# Altium project TEMP_HUMIDITY_INDICATOR.PrjPcb
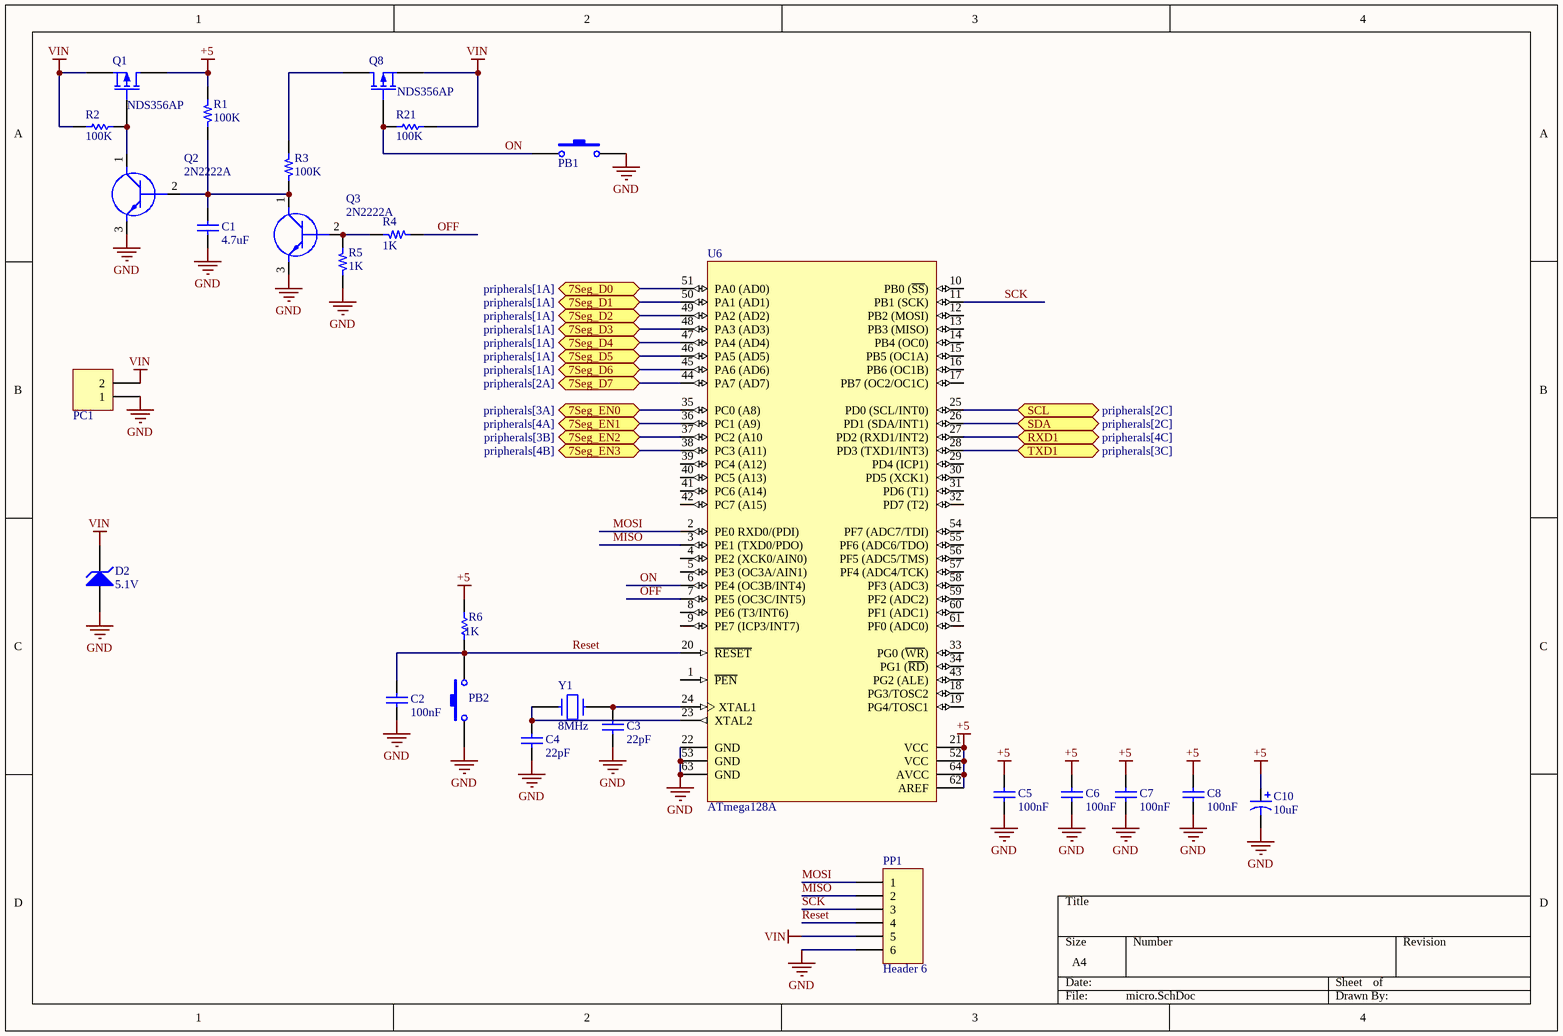
[diagram p0: micro.SchDoc]
2 sheets, 64 parts. Net scope: flat (ports and power ports of the same name join across sheets).
Board file: RHT.PcbDoc
Sheets:
  micro.SchDoc
  pripherals.SchDoc

## Sheet micro.SchDoc
size A4; SheetNumber: 1; SheetTotal: 2; SPICEModelCacheOPHJYIUV: <root> / <DocumentId>OPHJYIUV</DocumentId> / <CacheFrame Number="0"> / <Model Name="cap" Kind="MDL"> / <Text>*Default semiconductor capacitor / .MODEL CAP C()</Text> / </Model> / </CacheFrame> / </root>

### Parts
C1  value 4.7uF  [CAP0805]  (hidden comment: cap 4.7uF)
C2  value 100nF  [CAP0805]  (hidden comment: cap 100nF)
C3  value 22pF  [CAP0805]  (hidden comment: cap 22pF)
C4  value 22pF  [CAP0805]  (hidden comment: cap 22pF)
C5  value 100nF  [CAP0805]  (hidden comment: cap 100nF)
C6  value 100nF  [CAP0805]  (hidden comment: cap 100nF)
C7  value 100nF  [CAP0805]  (hidden comment: cap 100nF)
C8  value 100nF  [CAP0805]  (hidden comment: cap 100nF)
C10  value 10uF  [CAP0805]  (hidden comment: cap 10uF)
D2  5.1V  [Diode 1n4148 SMD]
PB1  Push-Button-tall  [tact-12mm]  (value not drawn)
PB2  Push-Button-tall  [tack-sw-3x5x6]  (value not drawn)
PC1  Power Connector  [My_ Power_Connector]  (value not drawn)
PP1  Header 6  [HDR1X6]
Q1  NDS356AP  [soT95p280x130-3n]
Q2  2N2222A  [soT95p280x130-3n]
Q3  2N2222A  [soT95p280x130-3n]
Q8  NDS356AP  [soT95p280x130-3n]
R1  100K  [RES0805]
R2  value 100K  [RES0805]  (hidden comment: Res 100K)
R3  100K  [RES0805]
R4  1K  [RES0805]
R5  1K  [RES0805]
R6  value 1K  [RES0805]  (hidden comment: Res 1K)
R21  value 100K  [RES0805]  (hidden comment: Res 100K)
U6  ATmega128A  [TQFP64_N]
Y1  8MHz  [My_Crystal]

### Ports
7Seg_D0 (bidir, see pripherals[1A]), 7Seg_D1 (bidir, see pripherals[1A]), 7Seg_D2 (bidir, see pripherals[1A]), 7Seg_D3 (bidir, see pripherals[1A]), 7Seg_D4 (bidir, see pripherals[1A]), 7Seg_D5 (bidir, see pripherals[1A]), 7Seg_D6 (bidir, see pripherals[1A]), 7Seg_D7 (bidir, see pripherals[2A]), 7Seg_EN0 (bidir, see pripherals[3A]), 7Seg_EN1 (bidir, see pripherals[4A]), 7Seg_EN2 (bidir, see pripherals[3B]), 7Seg_EN3 (bidir, see pripherals[4B]), RXD1 (bidir, see pripherals[4C]), SCL (bidir, see pripherals[2C]), SDA (bidir, see pripherals[2C]), TXD1 (bidir, see pripherals[3C])

### Nets
+5: C5.2 C6.2 C7.2 C8.2 C10.1 Q1.1(D) R1.1 R6.1 U6.21(VCC) U6.52(VCC) U6.62(AREF) U6.64(AVCC)
GND: C1.1 C2.1 C3.1 C4.1 C5.1 C6.1 C7.1 C8.1 C10.2 D2.1(A) PB1.2 PB2.1 PC1.1 PP1.6 Q2.3(E) Q3.3(E) R5.1 U6.22(GND) U6.53(GND) U6.63(GND)
VIN: D2.2(K) PC1.2 PP1.5 Q1.3(S) Q8.3(S) R2.1 R21.1
MISO: PP1.2 U6.3(PE1_(TXD0/PDO))
MOSI: PP1.1 U6.2(PE0_RXD0/(PDI))
OFF: R4.1 U6.7(PE5_(OC3C/INT5))
ON: PB1.1 Q8.2(G) R21.2 U6.6(PE4_(OC3B/INT4))
Reset: C2.2 PB2.2 PP1.4 R6.2 U6.20(~{RESET})
SCK: PP1.3 U6.11(PB1_(SCK))
SCL: U6.25(PD0_(SCL/INT0)) ; port SCL
SDA: U6.26(PD1_(SDA/INT1)) ; port SDA
NetC1_2: C1.2 Q2.2(B) Q3.1(C) R1.2 R3.2
NetC3_2: C3.2 U6.24(XTAL1) Y1.2
NetC4_2: C4.2 U6.23(XTAL2) Y1.1
NetQ1_2: Q1.2(G) Q2.1(C) R2.2
NetQ3_2: Q3.2(B) R4.2 R5.2
NetQ4_2: U6.35(PC0_(A8)) ; port 7Seg_EN0
NetQ5_2: U6.36(PC1_(A9)) ; port 7Seg_EN1
NetQ6_2: U6.37(PC2_(A10) ; port 7Seg_EN2
NetQ7_2: U6.38(PC3_(A11)) ; port 7Seg_EN3
NetQ8_1: Q8.1(D) R3.1
NetR16_1: U6.44(PA7_(AD7)) ; port 7Seg_D7
NetU4_1: U6.51(PA0_(AD0)) ; port 7Seg_D0
NetU4_2: U6.50(PA1_(AD1)) ; port 7Seg_D1
NetU4_3: U6.49(PA2_(AD2)) ; port 7Seg_D2
NetU4_4: U6.48(PA3_(AD3)) ; port 7Seg_D3
NetU4_5: U6.47(PA4_(AD4)) ; port 7Seg_D4
NetU4_6: U6.46(PA5_(AD5)) ; port 7Seg_D5
NetU4_7: U6.45(PA6_(AD6)) ; port 7Seg_D6
NetU5_1: U6.28(PD3_(TXD1/INT3)) ; port TXD1
NetU5_5: U6.27(PD2_(RXD1/INT2)) ; port RXD1

Not connected (* = marked no-connect by the designer): U6 1(~{PEN}) 4(PE2_(XCK0/AIN0)) 5(PE3_(OC3A/AIN1)) 8(PE6_(T3/INT6)) 9(PE7_(ICP3/INT7)) 10(PB0_(~{SS})) 12(PB2_(MOSI)) 13(PB3_(MISO)) 14(PB4_(OC0)) 15(PB5_(OC1A)) 16(PB6_(OC1B)) 17(PB7_(OC2/OC1C)) 18(PG3/TOSC2) 19(PG4/TOSC1) 29(PD4_(ICP1)) 30(PD5_(XCK1)) 31(PD6_(T1)) 32(PD7_(T2)) 33(PG0_(~{WR})) 34(PG1_(~{RD})) 39(PC4_(A12)) 40(PC5_(A13)) 41(PC6_(A14)) 42(PC7_(A15)) 43(PG2_(ALE)) 54(PF7_(ADC7/TDI)) 55(PF6_(ADC6/TDO)) 56(PF5_(ADC5/TMS)) 57(PF4_(ADC4/TCK)) 58(PF3_(ADC3)) 59(PF2_(ADC2)) 60(PF1_(ADC1)) 61(PF0_(ADC0))

### Library data of the parts
C1-C8 = Cap ceramic: CAP seramic
C10 = Cap Pol1: CAP seramic; Published: 8-Jun-2000; LatestRevisionDate: 17-Jul-2002; LatestRevisionNote: Re-released for DXP Platform.; PackageReference: RB7.6-15; Publisher: Altium Limited; PackageDescription: Polarized Capacitor (Radial); 2 Leads
D2 = D Zener: Zener Diode 5.1v; Published: 8-Jun-2000; LatestRevisionDate: 17-Jul-2002; LatestRevisionNote: Re-released for DXP Platform.; PackageReference: DIODE-0.7; Publisher: Altium Limited; PackageDescription: Diode, Thru-Hole; 2 Leads; 0.7 in Pin Spacing
PC1 = Power Connector: white Power Connector
PP1 = Header 6: Header, 6-Pin , female; LatestRevisionDate: 17-Jul-2002; LatestRevisionNote: Re-released for DXP Platform.; Publisher: Altium Limited
Q1 Q8 = MOSFET-P: P-Channel MOSFET SOT23; pin to pad: 1>3 2>1 3>2; Published: 8-Jun-2000; LatestRevisionDate: 17-Jul-2002; LatestRevisionNote: Re-released for DXP Platform.; PackageVersion: 1995/1996; PackageReference: E3; Publisher: Altium Limited; PackageDescription: TO, Flat Index; 3 In-Line, Axial Leads; Body Dia. 4.6mm; Lead Dia. 0.5 mm (max)
Q2 Q3 = 2N2222A: Transistor BJT NPN SMD; pin to pad: 1>3 2>1 3>2; Manufacturer_Name: Foshan Blue Rocket Elec; Datasheet Link: https://datasheet.lcsc.com/szlcsc/1901291437_Foshan-Blue-Rocket-Elec-2N2222A_C358533.pdf; Height: 4.7mm; Manufacturer_Part_Number: 2N2222A
R1 R3-R5 = Resistor: RES SMD 0603; Part Number: RCS0805100KFKEA
  R1 R3: Value: 100K
  R4 R5: Value: 1K
R2 R6 R21 = Res1: Resistor; Published: 8-Jun-2000; LatestRevisionDate: 17-Jul-2002; LatestRevisionNote: Re-released for DXP Platform.; PackageReference: AXIAL-0.3; Publisher: Altium Limited; PackageDescription: Axial Device, Thru-Hole; 2 Leads; 0.3 in Pin Spacing
U6 = ATmega128A: 8-bit AVR Microcontroller, 128KB Flash, 4KB EEPROM, 4KB SRAM, 64-pin TQFP, Industrial Grade (-40°C to 85°C); Published: 1-Apr-2010; DatasheetVersion: revE, Feb-2010; PackageVersion: revB, Oct-2001; PackageReference: 64A; Publisher: Altium Limited; PackageDescription: 64-Pin Plastic Thin Profile Quad Flat Pack, 14 x 14 x 1.0 mm Body, 0.8 mm Pitch (TQFP); Supplier 1: Digi-Key; Supplier Part Number 1: ATMEGA128A-AU-ND; Supplier 2: Farnell; Supplier Part Number 2: 1773397; Supplier 3: Mouser; Supplier Part Number 3: 556-ATMEGA128A-AU; Code_JEDEC: MS-026-AEB; ComponentLink1Description: Manufacturer Link; ComponentLink1URL: http://www.atmel.com/products/avr/default.asp?; ComponentLink2Description: ATmega128A Datasheet; ComponentLink2URL: http://www.atmel.com/dyn/resources/prod_documents/doc8151.pdf; ComponentLink3Description: ATmega128A Summary; ComponentLink3URL: http://www.atmel.com/dyn/resources/prod_documents/8151S.pdf; ComponentLink4Description: Atmel.com Home; ComponentLink4URL: http://www.atmel.com
Y1 = CRYSTAL

## Sheet pripherals.SchDoc
size A4; SheetNumber: 2; SheetTotal: 2; SPICEModelCacheJVNAYKJN: <root> / <DocumentId>JVNAYKJN</DocumentId> / <CacheFrame Number="0"> / <Model Name="cap" Kind="MDL"> / <Text>*Default semiconductor capacitor / .MODEL CAP C()</Text> / </Model> / </CacheFrame> / </root>
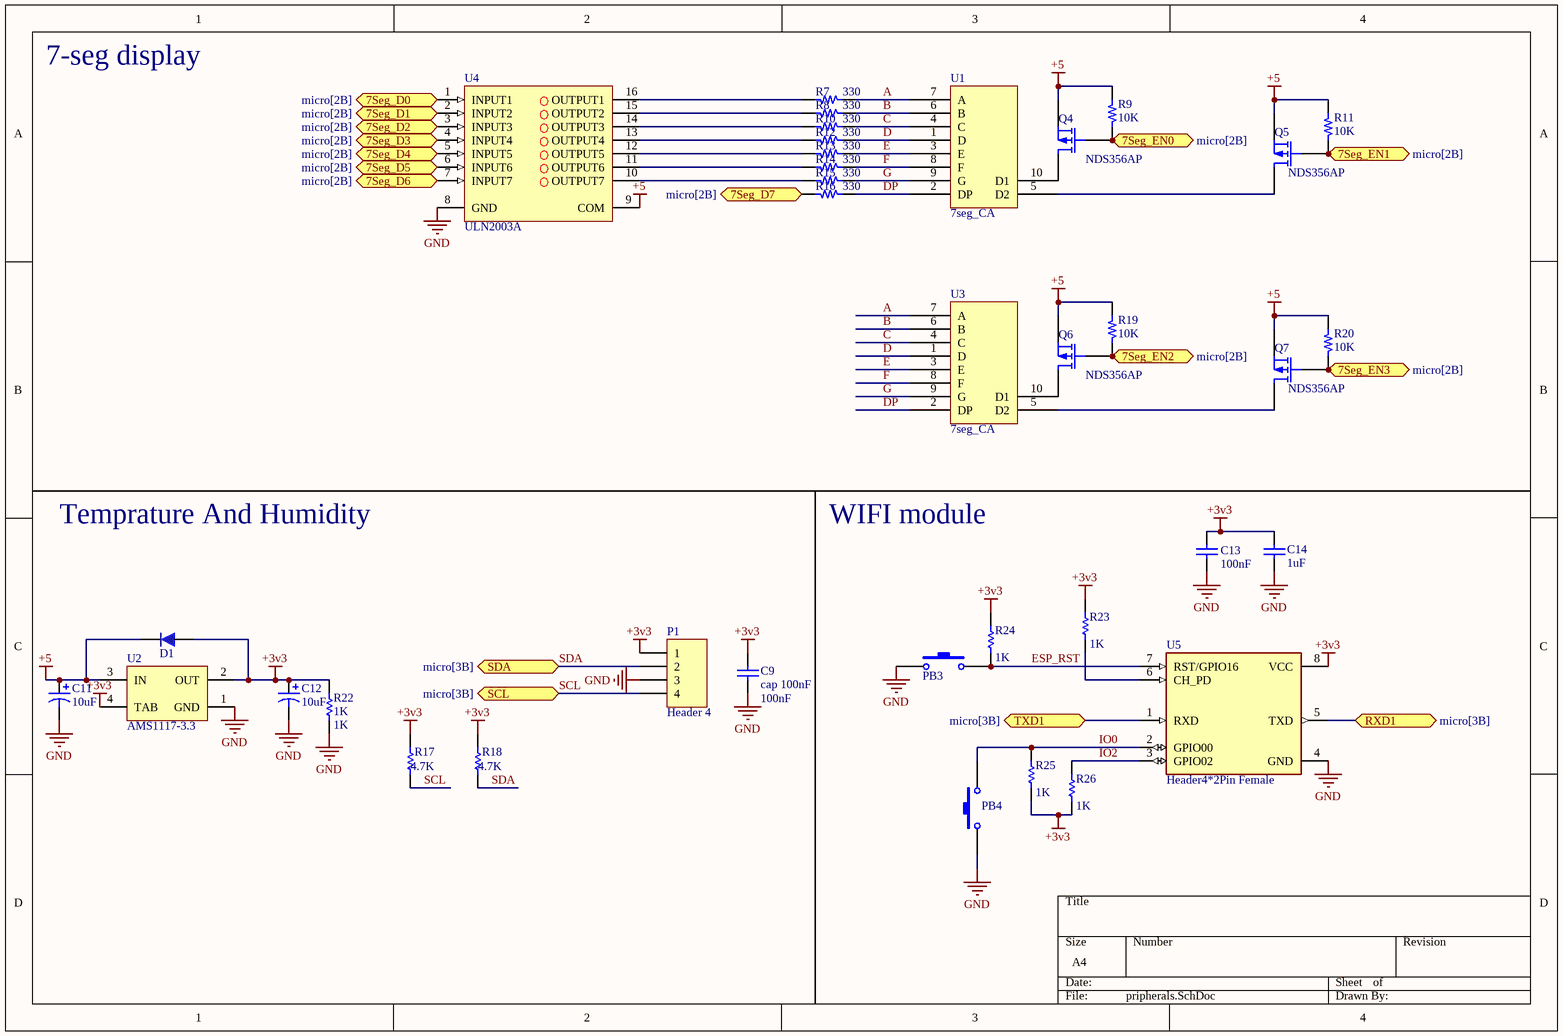
[diagram p1: pripherals.SchDoc]

### Parts
C9  cap 100nF  value 100nF  [Cap 805]
C11  value 10uF  [CAP0805]  (hidden comment: cap 10uF)
C12  value 10uF  [CAP0805]  (hidden comment: cap 10uF)
C13  value 100nF  [CAP0805]  (hidden comment: cap 100nF)
C14  value 1uF  [CAP0805]  (hidden comment: cap 1uF)
D1  uf4007  [DIOM4629X24N]  (value not drawn)
P1  Header 4  [HDR1X4]
PB3  Push-Button-tall  [tack-sw-3x5x6]  (value not drawn)
PB4  Push-Button-tall  [tack-sw-3x5x6]  (value not drawn)
Q4  NDS356AP  [soT95p280x130-3n]
Q5  NDS356AP  [soT95p280x130-3n]
Q6  NDS356AP  [soT95p280x130-3n]
Q7  NDS356AP  [soT95p280x130-3n]
R7  330  [RES0805]
R8  330  [RES0805]
R9  10K  [RES0805]
R10  330  [RES0805]
R11  10K  [RES0805]
R12  330  [RES0805]
R13  330  [RES0805]
R14  330  [RES0805]
R15  330  [RES0805]
R16  330  [RES0805]
R17  value 4.7K  [RES0805]  (hidden comment: Res 4.7K)
R18  value 4.7K  [RES0805]  (hidden comment: Res 4.7K)
R19  10K  [RES0805]
R20  10K  [RES0805]
R22  1K  [RES0805]
R23  value 1K  [RES0805]  (hidden comment: Res 1K)
R24  value 1K  [RES0805]  (hidden comment: Res 1K)
R25  value 1K  [RES0805]  (hidden comment: Res 1K)
R26  value 1K  [RES0805]  (hidden comment: Res 1K)
U1  7seg_CA  [7seg]
U2  AMS1117-3.3  [SOT223]
U3  7seg_CA  [7seg]
U4  ULN2003A  [SO16_N]
U5  Header4*2Pin Female  [ESP8266-01/ESP-01]

### Ports
7Seg_D0 (bidir, see micro[2B]), 7Seg_D1 (bidir, see micro[2B]), 7Seg_D2 (bidir, see micro[2B]), 7Seg_D3 (bidir, see micro[2B]), 7Seg_D4 (bidir, see micro[2B]), 7Seg_D5 (bidir, see micro[2B]), 7Seg_D6 (bidir, see micro[2B]), 7Seg_D7 (bidir, see micro[2B]), 7Seg_EN0 (bidir, see micro[2B]), 7Seg_EN1 (bidir, see micro[2B]), 7Seg_EN2 (bidir, see micro[2B]), 7Seg_EN3 (bidir, see micro[2B]), RXD1 (bidir, see micro[3B]), SCL (bidir, see micro[3B]), SDA (bidir, see micro[3B]), TXD1 (bidir, see micro[3B])

### Nets
+3v3: C9.2 C12.1 C13.2 C14.1 D1.1 P1.1 R17.1 R18.1 R22.2 R23.1 R24.1 R25.2 R26.2 U2.2(OUT) U2.4(TAB) U5.8(VCC)
+5: C11.1 D1.2 Q4.3(S) Q5.3(S) Q6.3(S) Q7.3(S) R9.1 R11.1 R19.1 R20.1 U2.3(IN) U4.9(COM)
GND: C9.1 C11.2 C12.2 C13.1 C14.2 P1.3 PB3.1 PB4.1 R22.1 U2.1(GND) U4.8(GND) U5.4(GND)
A: R7.2 U1.7(A) U3.7(A)
B: R8.2 U1.6(B) U3.6(B)
C: R10.2 U1.4(C) U3.4(C)
D: R12.2 U1.1(D) U3.1(D)
DP: R16.2 U1.2(DP) U3.2(DP)
E: R13.2 U1.3(E) U3.3(E)
ESP_RST: PB3.2 R24.2 U5.7(RST/GPIO16)
F: R14.2 U1.8(F) U3.8(F)
G: R15.2 U1.9(G) U3.9(G)
IO0: PB4.2 R25.1 U5.2(GPIO00)
IO2: R26.1 U5.3(GPIO02)
SCL: P1.4 R17.2 ; port SCL
SDA: P1.2 R18.2 ; port SDA
NetQ4_1: Q4.1(D) U1.10(D1)
NetQ4_2: Q4.2(G) R9.2 ; port 7Seg_EN0
NetQ5_1: Q5.1(D) U1.5(D2)
NetQ5_2: Q5.2(G) R11.2 ; port 7Seg_EN1
NetQ6_1: Q6.1(D) U3.10(D1)
NetQ6_2: Q6.2(G) R19.2 ; port 7Seg_EN2
NetQ7_1: Q7.1(D) U3.5(D2)
NetQ7_2: Q7.2(G) R20.2 ; port 7Seg_EN3
NetR7_1: R7.1 U4.16(OUTPUT1)
NetR8_1: R8.1 U4.15(OUTPUT2)
NetR10_1: R10.1 U4.14(OUTPUT3)
NetR12_1: R12.1 U4.13(OUTPUT4)
NetR13_1: R13.1 U4.12(OUTPUT5)
NetR14_1: R14.1 U4.11(OUTPUT6)
NetR15_1: R15.1 U4.10(OUTPUT7)
NetR16_1: R16.1 ; port 7Seg_D7
NetR23_2: R23.2 U5.6(CH_PD)
NetU4_1: U4.1(INPUT1) ; port 7Seg_D0
NetU4_2: U4.2(INPUT2) ; port 7Seg_D1
NetU4_3: U4.3(INPUT3) ; port 7Seg_D2
NetU4_4: U4.4(INPUT4) ; port 7Seg_D3
NetU4_5: U4.5(INPUT5) ; port 7Seg_D4
NetU4_6: U4.6(INPUT6) ; port 7Seg_D5
NetU4_7: U4.7(INPUT7) ; port 7Seg_D6
NetU5_1: U5.1(RXD) ; port TXD1
NetU5_5: U5.5(TXD) ; port RXD1

### Notes on the sheet
- 7-seg display
- Temprature And Humidity
- WIFI module

### Library data of the parts
C9 = Cap: Capacitor; Published: 8-Jun-2000; LatestRevisionDate: 17-Jul-2002; LatestRevisionNote: Re-released for DXP Platform.; PackageReference: RAD-0.3; Publisher: Altium Limited; PackageDescription: Radial Cap, Thru-Hole; 2 Leads; 0.3 in Pin Spacing
C11 C12 = Cap Pol1: CAP seramic; Published: 8-Jun-2000; LatestRevisionDate: 17-Jul-2002; LatestRevisionNote: Re-released for DXP Platform.; PackageReference: RB7.6-15; Publisher: Altium Limited; PackageDescription: Polarized Capacitor (Radial); 2 Leads
C13 C14 = Cap ceramic: CAP seramic
D1 = 1n4007 SMD M7: Standard Rectifiers; Part. No: M7; Manufacturer: DC COMPONENTS; Designer: Abbas Basereh; Link: http://www.tme.eu/en/details/m7/smd-universal-diodes/dc-components/; Link: https://www.aliexpress.com/item/Smd-tube-1n4007-m7-SMA/1213719741.html?spm=2114.01010208.3.1.ZyZ7bC&ws_ab_test=searchweb0_0,searchweb201602_4_10065_10068_10084_10083_10080_10082_10081_10060_10061_10062_10056_10055_10054_10059_10099_10078_10079_427_10073_10103_10102_10096_10052_10050_10051,searchweb201603_4&btsid=db2be5ca-e560-400a-b91c-484ab5ee228b; Data: 16-12-2016
P1 = Header 4: Header, 4-Pin; LatestRevisionDate: 17-Jul-2002; LatestRevisionNote: Re-released for DXP Platform.; Publisher: Altium Limited
Q4-Q7 = MOSFET-P: P-Channel MOSFET SOT23; pin to pad: 1>3 2>1 3>2; Published: 8-Jun-2000; LatestRevisionDate: 17-Jul-2002; LatestRevisionNote: Re-released for DXP Platform.; PackageVersion: 1995/1996; PackageReference: E3; Publisher: Altium Limited; PackageDescription: TO, Flat Index; 3 In-Line, Axial Leads; Body Dia. 4.6mm; Lead Dia. 0.5 mm (max)
R7-R16 R19 R20 = Resistor: as R1 on sheet micro
  R7 R8 R10 R12-R16: Value: 330
  R9 R11 R19 R20: Value: 10K
R17 R18 R22-R26 = Res1: Resistor; Published: 8-Jun-2000; LatestRevisionDate: 17-Jul-2002; LatestRevisionNote: Re-released for DXP Platform.; PackageReference: AXIAL-0.3; Publisher: Altium Limited; PackageDescription: Axial Device, Thru-Hole; 2 Leads; 0.3 in Pin Spacing
  R22: Value: 1K
U1 U3 = 7Seg-2digit-ca
U2 = AMS1117-x.x: x.x Volt, 800mA Low-Dropout Linear Regulator, 4-pin SOT-223; Designer: Ali Hafizi; Data: 16-12-2016
U4 = ULN2003A: SEVEN DARLINGTON ARRAYS; Published: 2017-3-2; DatasheetVersion: STMicroelectronics GROUP OF COMPANIES; PackageVersion: 2017-3-2; PackageReference: SO16_N; Publisher: Abbas Basereh; PackageDescription: 16-Pin Small Outline Integrated Circuit 1.27 mm Pitch, IPC High Density; Supplier 1: Digi-Key; Supplier Part Number 1: ULN2003A; Supplier 2: Mouser; Supplier Part Number 2: ULN2003A; ComponentLink1Description: Datasheet; ComponentLink2URL: http://www.st.com
U5 = ESP8266-01/ESP-01: ESP-01 wifi module; MF: AI-Thinker; Package: None; Availability: Unavailable; MP: ESP8266-01/ESP-01; Value: *; SnapEDA_Link: https://www.snapeda.com/parts/ESP8266-01/ESP-01/AI-Thinker/view-part/106413/?ref=snap; Price: None

## Nets that join several sheets
+5: micro (12 pins), pripherals (12 pins)
GND: micro (20 pins), pripherals (12 pins)
NetQ4_2: micro (U6.35), pripherals (Q4.2 R9.2)
NetQ5_2: micro (U6.36), pripherals (Q5.2 R11.2)
NetQ6_2: micro (U6.37), pripherals (Q6.2 R19.2)
NetQ7_2: micro (U6.38), pripherals (Q7.2 R20.2)
NetR16_1: micro (U6.44), pripherals (R16.1)
NetU4_1: micro (U6.51), pripherals (U4.1)
NetU4_2: micro (U6.50), pripherals (U4.2)
NetU4_3: micro (U6.49), pripherals (U4.3)
NetU4_4: micro (U6.48), pripherals (U4.4)
NetU4_5: micro (U6.47), pripherals (U4.5)
NetU4_6: micro (U6.46), pripherals (U4.6)
NetU4_7: micro (U6.45), pripherals (U4.7)
NetU5_1: micro (U6.28), pripherals (U5.1)
NetU5_5: micro (U6.27), pripherals (U5.5)
SCL: micro (U6.25), pripherals (P1.4 R17.2)
SDA: micro (U6.26), pripherals (P1.2 R18.2)